# EAGLE design in3controlpanel (EAGLE 7.7.0)
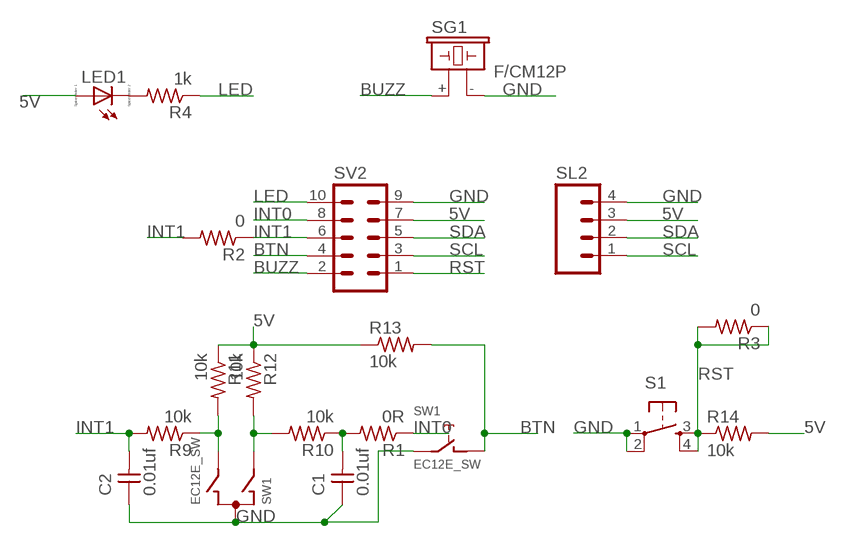
[diagram p0: schematic, sheet 1]

## Parts
C1  0.01uf  UNPOLARIZED_CAPACITOR1206  [1206]
C2  0.01uf  UNPOLARIZED_CAPACITOR1206  [1206]
LED1  LED_E  [LED_1206]
R1  0R  RESISTOR1206  [1206]
R2  0  RESISTOR1206  [1206]
R3  0  RESISTOR1206  [1206]
R4  1k  RESISTOR1206  [1206]
R9  10k  RESISTOR1206  [1206]
R10  10k  RESISTOR1206  [1206]
R11  10k  RESISTOR1206  [1206]
R12  10k  RESISTOR1206  [1206]
R13  10k  RESISTOR1206  [1206]
R14  10k  RESISTOR1206  [1206]
S1  6MM_SWITCH6MM_SWITCH  [6MM_SWITCH]
SG1  F/CM12P  [F/CM12P]
SL2  MA04  [04PA]
SV2  MA05-2  [MA05-2]
SW1  EC12E_SW  [ALPS_EC12E_SW]

## Nets
5V: LED1.A R11.1 R12.1 R13.1 R14.2 SL2.3 SV2.7
BTN: R13.2 SV2.4 SW1.D
BUZZ: SG1.+ SV2.2
GND: C1.1 C2.1 S1.1(P) S1.2(P1) SG1.- SL2.4 SV2.9 SW1.C SW1.E
INT0: C1.2 R1.1 R1.2 R10.1 SV2.8
INT1: C2.2 R2.1 R2.2 R9.2 SV2.6
LED: R4.1 SV2.10
N$1: LED1.C R4.2
N$5: R9.1 R11.2 SW1.B
N$8: R10.2 R12.2 SW1.A
RST: R3.1 R3.2 R14.1 S1.3(S) S1.4(S1) SV2.1
SCL: SL2.1 SV2.3
SDA: SL2.2 SV2.5
Unconnected: SW1.GND1(G) SW1.GND2(G)

## Library data of the parts
C1 C2 = 01_FAB_Hello:UNPOLARIZED_CAPACITOR: unpolarized_capacitor
LED1 = eagle-ltspice:LED_E: LED Source: http://www.osram.convergy.de Source: www.luxeon.com Source: www.kingbright.com; SPICEMODEL: NONE; SPICEPREFIX: D; SPICETYPE: diode
R1-R4 R9-R14 = ng:RESISTOR
S1 = 01_FAB_Hello:6MM_SWITCH: OMRON SWITCH
SG1 = buzzer:F/CM12P: BUZZER Source: Buerklin; OC_FARNELL: unknown; OC_NEWARK: unknown
SL2 = con-amp-quick:MA04: AMP QUICK CONNECTOR; OC_FARNELL: unknown; OC_NEWARK: unknown
SV2 = con-lstb:MA05-2: PIN HEADER; OC_FARNELL: unknown; OC_NEWARK: unknown
SW1 = switch-alps:EC12E_SW: ALPS rotary Encoder EC12E series with switch; MPN: EC12E2424407; OC_FARNELL: 1520813; OC_NEWARK: 74M1068

## Board
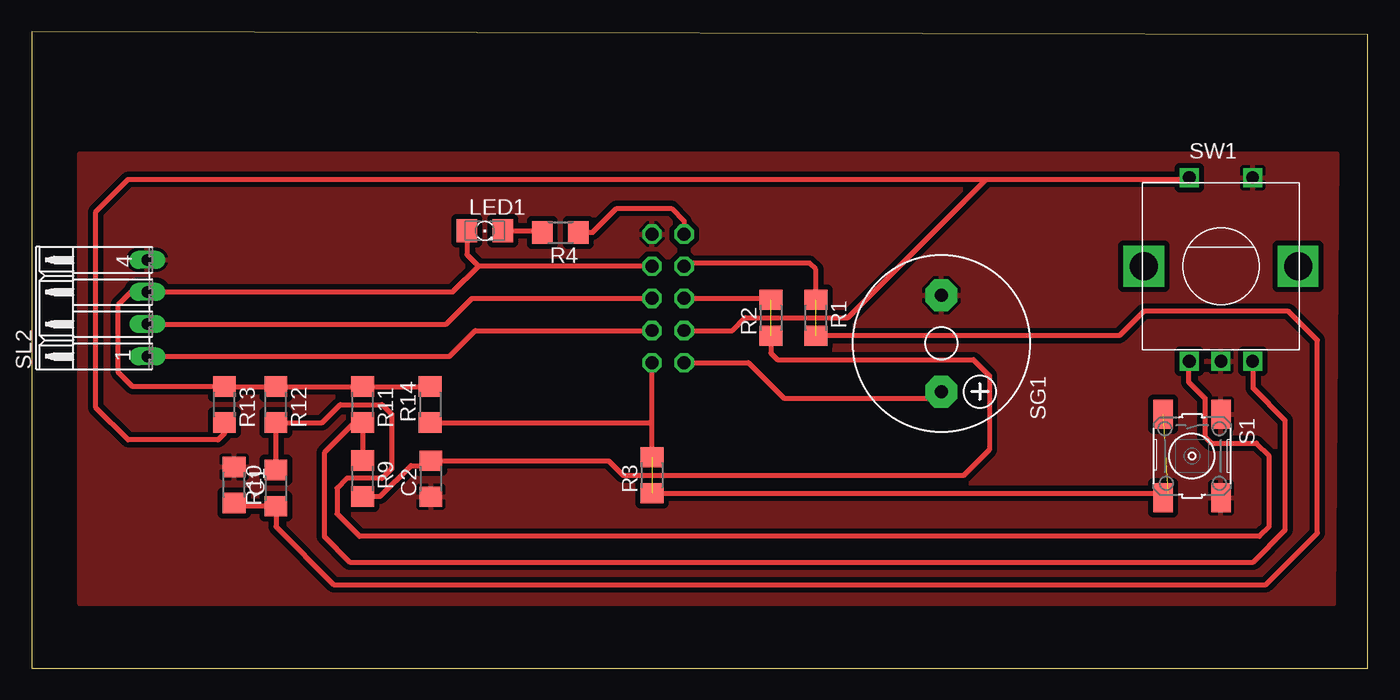
[diagram p1: board, top side]
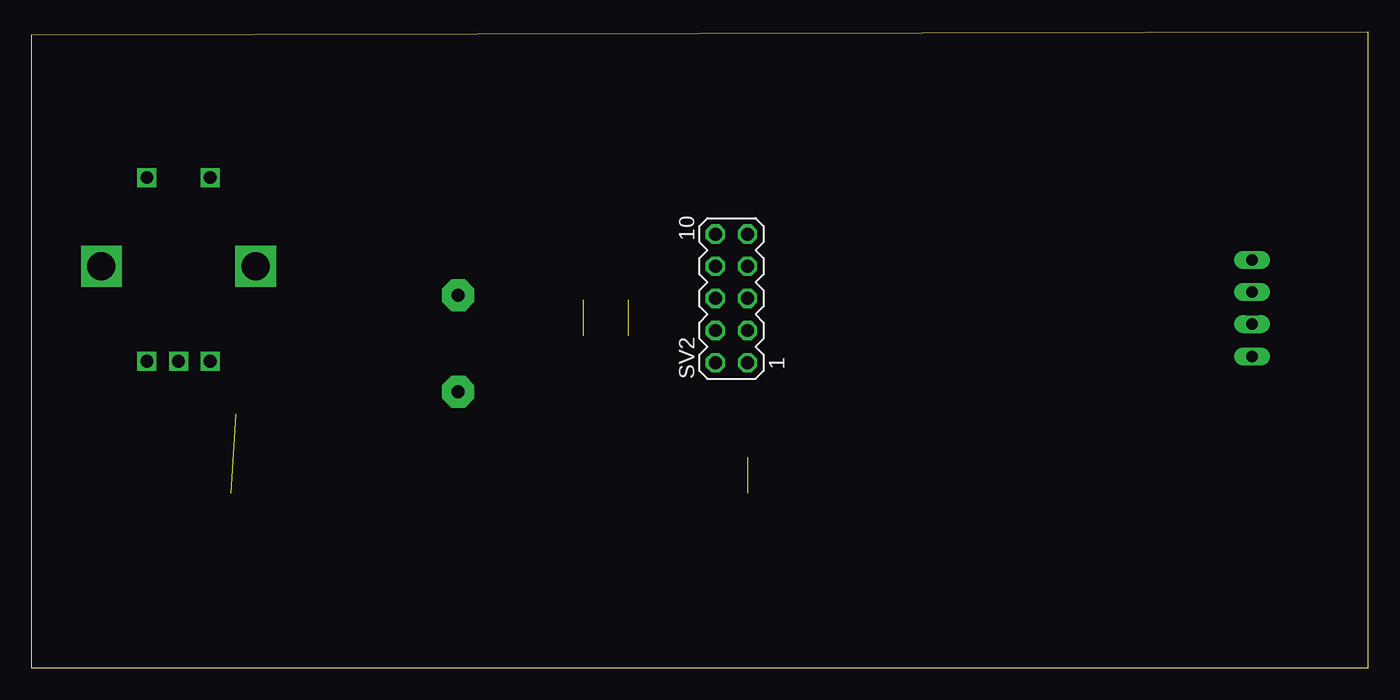
[diagram p2: board, bottom side, seen from below]

Size 105.59 x 50.28 mm. Coordinates in mm from the lower left corner, seen from the top.
Outline: 0,0 105.59,0 105.59,50.03 0,50.28 0,0
Copper layers (1*16): Top 0.035mm / dielectric 1.5mm / Bottom 0.035mm
Design rules "default *": minimum track width 10mil, minimum drill 24mil, track to track 16mil, track to pad 16mil, pad to pad 16mil, via to via 16mil, smd to smd 16mil, copper to edge 40mil, drill to drill 8mil, minimum pad ring 10mil, minimum via ring 8mil, stop-mask expansion 4mil, vias tented up to drill 0mil, thermal gap 10mil

### Footprints (pad centres in the part's own frame; a part is rotated, then mirrored left to right if it is on the bottom)
1206 = smd 1.6 x 1.803: 1 -1.422,0; 2 1.422,0
LED_1206 = smd 1.6 x 1.803: A -1.422,0; C 1.422,0
6MM_SWITCH = smd 2.286 x 1.524: 1 -3.302,2.286; 2 3.302,2.286; 3 -3.302,-2.286; 4 3.302,-2.286
F/CM12P = drill 1.016 pad 2.54 octagon: + 3.81,0; - -3.81,0
04PA = drill 0.914 long: 1 -3.81,0; 2 -1.27,0; 3 1.27,0; 4 3.81,0
MA05-2 = drill 1.016 octagon: 1 -5.08,-1.27; 2 -5.08,1.27; 3 -2.54,-1.27; 4 -2.54,1.27; 5 0,-1.27; 6 0,1.27; 7 2.54,-1.27; 8 2.54,1.27; 9 5.08,-1.27; 10 5.08,1.27
ALPS_EC12E_SW = drill 1 square: A -2.5,-7.5; B 2.5,-7.5; C 0,-7.5; D -2.5,7; E 2.5,7 | drill 2.2 square: GND1 -6.1,0; GND2 6.1,0

### Placement (x,y rotation side)
C1  16,14.48 270 top
C2  31.55,14.96 90 top
LED1  35.81,34.54 0 top
R1  61.98,27.69 270 top
R2  58.42,27.69 90 top
R3  49.02,15.24 90 top
R4  41.78,34.42 180 top
R9  26.16,14.99 270 top
R10  19.3,14.22 90 top
R11  26.16,20.83 270 top
R12  19.3,20.83 270 top
R13  15.24,20.83 270 top
R14  31.5,20.83 90 top
S1  91.69,16.76 270 top
SG1  71.88,25.65 270 top
SL2  9.14,28.45 90 top
SV2  50.29,29.21 90 bottom
SW1  93.98,31.75 0 top

### Tracks (layer width: path | path; a pad name or v marks a point on that pad's centre or on a via)
5V
  Top 0.406: R14.2 R11.1 R12.1 R13.1 7.98,22.25 6.86,23.37 6.86,28.7 7.87,29.72 SL2.3 33.27,29.72 35.31,31.75 | SV2.7 35.31,31.75 | 35.31,31.75 34.39,32.66 LED1.A
BTN
  Top 0.406: 75.44,38.61 7.62,38.61 5.08,36.07 5.08,20.57 7.62,18.03 14.73,18.03 15.24,18.54 R13.2 | 75.44,38.61 91.34,38.61 SW1.D | SV2.4 55.37,26.67 56.39,27.69 64.52,27.69 75.44,38.61
BUZZ
  Top 0.406: SV2.2 56.64,24.13 59.44,21.34 71.37,21.34 SG1.+
GND
  pour Top: 3.81,40.64 103.12,40.64 102.87,5.08 3.81,5.08
INT0  (1 unrouted)
  Top 0.406: C1.2 15.49,12.8 R10.1 19.3,11.18 23.88,6.6 97.54,6.6 101.6,10.67 101.6,25.91 99.31,28.19 87.88,28.19 85.95,26.26 R1.2 62.08,26.16 | R1.1 61.98,31.5 61.47,32 51.82,32 SV2.8
INT1  (1 unrouted)
  Top 0.406: R9.2 27.53,13.56 29.97,16 31.17,16 C2.2 45.59,16.38 46.74,15.24 73.66,15.24 75.69,17.27 75.69,23.11 74.42,24.38 58.93,24.38 58.42,24.89 R2.1 | SV2.6 58.32,29.21 R2.2
LED
  Top 0.406: R4.1 44.32,34.42 46.23,36.32 50.55,36.32 51.56,35.31 SV2.10
N$1
  Top 0.406: LED1.C 40.23,34.54 R4.2
N$5
  Top 0.406: R9.1 R11.2 25.5,19.41 23.11,17.02 23.11,10.41 25.15,8.38 96.52,8.38 99.06,10.92 99.06,19.56 96.52,22.1 96.52,24.21 SW1.B
N$8
  Top 0.406: R10.2 R12.2 22.96,19.41 24.38,20.83 27.69,20.83 28.45,20.07 28.45,15.75 27.69,14.99 24.89,14.99 24.13,14.22 24.13,12.19 25.91,10.41 97.03,10.41 97.79,11.18 97.79,16.76 96.77,17.78 93.22,17.78 92.71,18.29 92.71,21.34 91.44,22.61 91.44,24.21 SW1.A
RST  (2 unrouted)
  Top 0.406: R14.1 48.87,19.41 49.02,19.56 | R3.2 49.02,19.56 | 49.02,19.56 SV2.1 | R3.1 89.81,13.82 S1.4
SCL
  Top 0.406: SL2.1 33.02,24.64 35.05,26.67 SV2.3
SDA
  Top 0.406: SL2.2 32.77,27.18 34.8,29.21 SV2.5